# Altium schematic sheet Power_driver_AMP.SchDoc
size 420 x 297 mm; Scale: 1:1; DocumentType: Схема электрическая принципиальная; FirstReferrence: АБВГ.123456.001
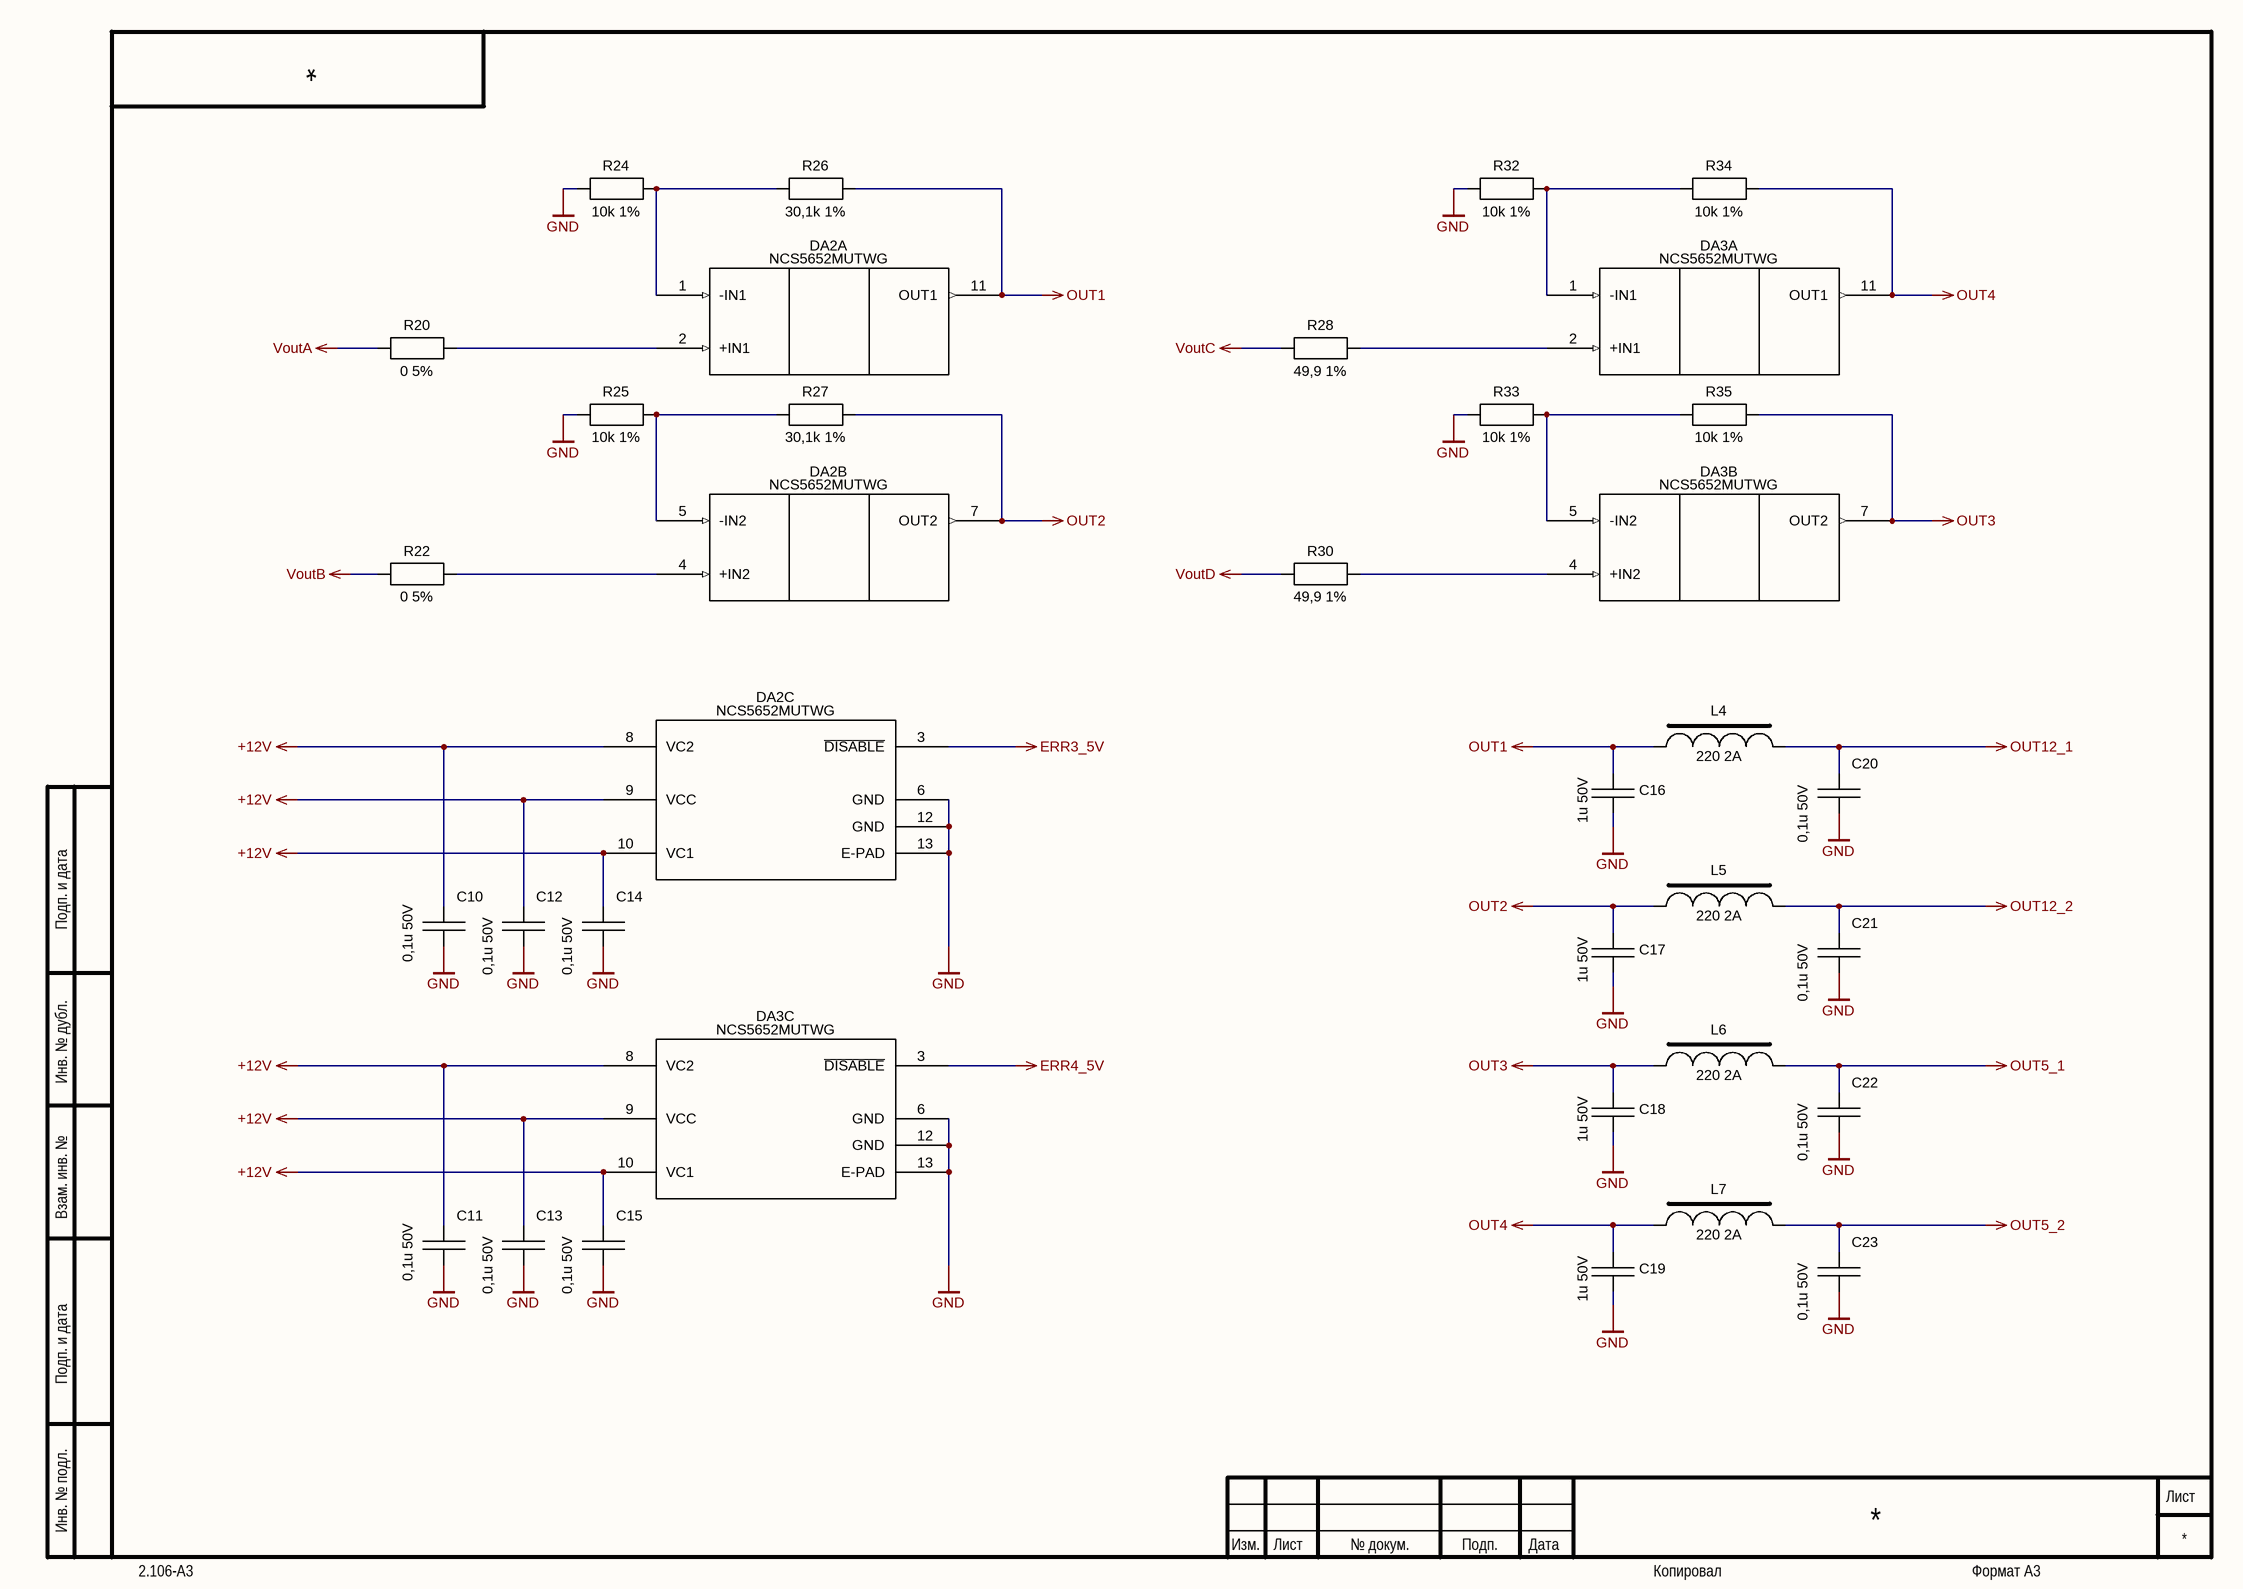
[diagram p0: Power_driver_AMP.SchDoc]

## Parts
C10  0,1u 50V  [C0603_CAPC1608X09N]
C11  0,1u 50V  [C0603_CAPC1608X09N]
C12  0,1u 50V  [C0603_CAPC1608X09N]
C13  0,1u 50V  [C0603_CAPC1608X09N]
C14  0,1u 50V  [C0603_CAPC1608X09N]
C15  0,1u 50V  [C0603_CAPC1608X09N]
C16  1u 50V  [C0603_CAPC1608X09N]
C17  1u 50V  [C0603_CAPC1608X09N]
C18  1u 50V  [C0603_CAPC1608X09N]
C19  1u 50V  [C0603_CAPC1608X09N]
C20  0,1u 50V  [C0603_CAPC1608X09N]
C21  0,1u 50V  [C0603_CAPC1608X09N]
C22  0,1u 50V  [C0603_CAPC1608X09N]
C23  0,1u 50V  [C0603_CAPC1608X09N]
DA2  NCS5652MUTWG  [UDFN12 3x3, 0.5P]  (parts A,B,C of 3)
DA3  NCS5652MUTWG  [UDFN12 3x3, 0.5P]  (parts A,B,C of 3)
L4  220 2A  [I0805_INDC2012X11N]
L5  220 2A  [I0805_INDC2012X11N]
L6  220 2A  [I0805_INDC2012X11N]
L7  220 2A  [I0805_INDC2012X11N]
R20  0 5%  [R0603_RESC1608X06N]
R22  0 5%  [R0603_RESC1608X06N]
R24  10k 1%  [R0603_RESC1608X06N]
R25  10k 1%  [R0603_RESC1608X06N]
R26  30,1k 1%  [R0603_RESC1608X06N]
R27  30,1k 1%  [R0603_RESC1608X06N]
R28  49,9 1%  [R0603_RESC1608X06N]
R30  49,9 1%  [R0603_RESC1608X06N]
R32  10k 1%  [R0603_RESC1608X06N]
R33  10k 1%  [R0603_RESC1608X06N]
R34  10k 1%  [R0603_RESC1608X06N]
R35  10k 1%  [R0603_RESC1608X06N]

## Nets
+12V: C10.1 C11.1 C12.1 C13.1 C14.1 C15.1 DA2.8(VC2) DA2.9(VCC) DA2.10(VC1) DA3.8(VC2) DA3.9(VCC) DA3.10(VC1)
ERR3_5V: DA2.3(~{DISABLE})
ERR4_5V: DA3.3(~{DISABLE})
GND: C10.2 C11.2 C12.2 C13.2 C14.2 C15.2 C16.1 C17.1 C18.1 C19.1 C20.2 C21.2 C22.2 C23.2 DA2.6(GND) DA2.12(GND) DA2.13(E-PAD) DA3.6(GND) DA3.12(GND) DA3.13(E-PAD) R24.1 R25.1 R32.1 R33.1
OUT1: C16.2 DA2.11(OUT1) L4.1 R26.2
OUT2: C17.2 DA2.7(OUT2) L5.1 R27.2
OUT3: C18.2 DA3.7(OUT2) L6.1 R35.2
OUT4: C19.2 DA3.11(OUT1) L7.1 R34.2
OUT5_1: C22.1 L6.2
OUT5_2: C23.1 L7.2
OUT12_1: C20.1 L4.2
OUT12_2: C21.1 L5.2
VoutA: R20.1
VoutB: R22.1
VoutC: R28.1
VoutD: R30.1
NetDA2_1: DA2.1(-IN1) R24.2 R26.1
NetDA2_2: DA2.2(+IN1) R20.2
NetDA2_4: DA2.4(+IN2) R22.2
NetDA2_5: DA2.5(-IN2) R25.2 R27.1
NetDA3_1: DA3.1(-IN1) R32.2 R34.1
NetDA3_2: DA3.2(+IN1) R28.2
NetDA3_4: DA3.4(+IN2) R30.2
NetDA3_5: DA3.5(-IN2) R33.2 R35.1

## Notes on the sheet
- Подп. и дата
- Инв. № дубл.
- Взам. инв. №
- Инв. № подл.
- Изм.
- Лист
- № докум.
- Подп.
- Дата
- 2.106-A3
- Копировал
- Формат А3

## Library data of the parts
C10-C15 C20-C23 = CC0603KRX7R9BB104: Конденсатор керамический (MLCC) общего назначения 0603; Manufacturer: YAGEO; ValueBOM: 0,1мкФ ±10% 50В X7R 0603; ModelSTEP: Z:\LIB\ALTIUM\MODEL\STEP\Capacitor\C0603_CAPC1608X09.Step; Designer: Dudarev; EOL: NO; PartNumber: CC0603KRX7R9BB104; ValueSCH: 0,1u 50V; Mount: SMT; HelpURL: Z:\LIB\ALTIUM\INFO\Capacitor\UPY-GPHC_X7R_6.3V-to-50V_13.pdf; Modify: 28.06.2016
C16-C19 = CC0603KRX7R9BB105: Конденсатор керамический (MLCC) общего назначения 0603; Manufacturer: YAGEO; ValueBOM: 1мкФ ±10% 50В X7R 0603; ModelSTEP: Z:\LIB\ALTIUM\MODEL\STEP\Capacitor\C0603_CAPC1608X09.Step; Designer: Dudarev; EOL: NO; PartNumber: CC0603KRX7R9BB105; ValueSCH: 1u 50V; Mount: SMT; HelpURL: Z:\LIB\ALTIUM\INFO\Capacitor\UPY-GPHC_X7R_6.3V-to-50V_13.pdf; Modify: 28.06.2016
DA2 DA3 = NCS5652MUTWG: High Speed, High Output Current, Dual Operational Amplifier, SMT
L4-L7 = BLM21PG221SN1D: Chip Ferrite Bead 220 Ohm, 2A, 0805; Manufacturer: Murata Electronics; ModelSTEP: Z:\LIB\ALTIUM\MODEL\STEP\Inductor\I0805_INDC2012X11.Step; Designer: Pashinskiy; EOL: NO; PartNumber: BLM21PG221SN1D; ValueBOM: BLM21PG221SN1D; ValueSCH: 220 2A; Mount: SMT; HelpURL: Z:\LIB\ALTIUM\INFO\Inductor\Chip%20Ferrite%20Bead%20BLM21P%200805.pdf; Modify: 16.08.2016
R20 R22 = RC0603JR-070RL: Резистор толстопленочный общего назначения 0603; Manufacturer: YAGEO; ValueBOM: 0Ом 5% 75В 300ppm 0603; ModelSTEP: Z:\LIB\ALTIUM\MODEL\STEP\Resistor\R0603_RESC1005X04.step; Designer: Dudarev; EOL: NO; PartNumber: RC0603JR-070RL; ValueSCH: 0 5%; Mount: SMT; HelpURL: Z:\LIB\ALTIUM\INFO\Resistor\YAGEO\Lead free chip resistors RC_P.pdf; Modify: 28.06.2016
R24 R25 R32-R35 = RC0603FR-0710KL: Резистор толстопленочный общего назначения 0603; Manufacturer: YAGEO; ValueBOM: 10кОм 1% 75В 150ppm 0603; ModelSTEP: Z:\LIB\ALTIUM\MODEL\STEP\Resistor\R0603_RESC1005X04.step; Designer: Dudarev; EOL: NO; PartNumber: RC0603FR-0710KL; ValueSCH: 10k 1%; Mount: SMT; HelpURL: Z:\LIB\ALTIUM\INFO\Resistor\YAGEO\Lead free chip resistors RC_P.pdf; Modify: 28.06.2016
R26 R27 = RC0603FR-0730K1L: Резистор толстопленочный общего назначения 0603; Manufacturer: YAGEO; ValueBOM: 30,1кОм 1% 75В 150ppm 0603; ModelSTEP: Z:\LIB\ALTIUM\MODEL\STEP\Resistor\R0603_RESC1005X04.step; Designer: Dudarev; EOL: NO; PartNumber: RC0603FR-0730K1L; ValueSCH: 30,1k 1%; Mount: SMT; HelpURL: Z:\LIB\ALTIUM\INFO\Resistor\YAGEO\Lead free chip resistors RC_P.pdf; Modify: 28.06.2016
R28 R30 = RC0603FR-0749R9L: Резистор толстопленочный общего назначения 0603; Manufacturer: YAGEO; ValueBOM: 49,9Ом 1% 75В 200ppm 0603; ModelSTEP: Z:\LIB\ALTIUM\MODEL\STEP\Resistor\R0603_RESC1005X04.step; Designer: Dudarev; EOL: NO; PartNumber: RC0603FR-0749R9L; ValueSCH: 49,9 1%; Mount: SMT; HelpURL: Z:\LIB\ALTIUM\INFO\Resistor\YAGEO\Lead free chip resistors RC_P.pdf; Modify: 28.06.2016